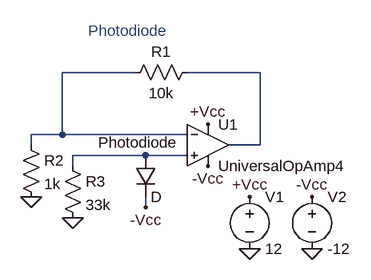
[diagram p0: schematic diode.asc]
diode.asc, the LTspice schematic file:
Version 4
SHEET 1 880 680
WIRE 32 -496 -80 -496
WIRE 224 -496 112 -496
WIRE -80 -400 -80 -496
WIRE -80 -400 -128 -400
WIRE 112 -400 -80 -400
WIRE -128 -384 -128 -400
WIRE 224 -384 224 -496
WIRE 224 -384 176 -384
WIRE 48 -368 -64 -368
WIRE 112 -368 48 -368
WIRE -64 -352 -64 -368
WIRE 48 -288 48 -304
FLAG 144 -416 +Vcc
FLAG 144 -352 -Vcc
FLAG -64 -272 0
FLAG -128 -304 0
FLAG 48 -288 -Vcc
FLAG 208 -224 0
FLAG 304 -224 0
FLAG 208 -304 +Vcc
FLAG 304 -304 -Vcc
SYMBOL OpAmps\\UniversalOpAmp4 144 -384 R0
SYMATTR InstName U1
SYMBOL res 128 -512 R90
WINDOW 0 0 56 VBottom 2
WINDOW 3 32 56 VTop 2
SYMATTR InstName R1
SYMATTR Value 10k
SYMBOL res -144 -400 R0
SYMATTR InstName R2
SYMATTR Value 1k
SYMBOL res -80 -368 R0
SYMATTR InstName R3
SYMATTR Value 33k
SYMBOL diode 32 -368 R0
WINDOW 0 -57 -20 Left 2
SYMATTR InstName Photodiode
SYMBOL voltage 208 -320 R0
WINDOW 123 0 0 Left 0
WINDOW 39 0 0 Left 0
SYMATTR InstName V1
SYMATTR Value 12
SYMBOL voltage 304 -320 R0
WINDOW 123 0 0 Left 0
WINDOW 39 0 0 Left 0
SYMATTR InstName V2
SYMATTR Value -12
TEXT -40 -560 Left 2 ;Photodiode

The netlist it stands for:
* diode.asc
* U1: UniversalOpAmp4 (symbol OpAmps\UniversalOpAmp4 not available, pins judged from their places): In+=N003 In-=N001 V+=+Vcc V-=-Vcc OUT=N002
R1 N002 N001 10k
R2 N001 0 1k
R3 N003 0 33k
D§Photodiode N003 -Vcc D
V1 +Vcc 0 12
V2 -Vcc 0 -12
.model D D
.lib standard.dio
* Photodiode
.backanno
.end